# Altium schematic sheet DCDC-SPX3829m5.SchDoc
size Letter; SheetNumber: 4; SheetTotal: 7
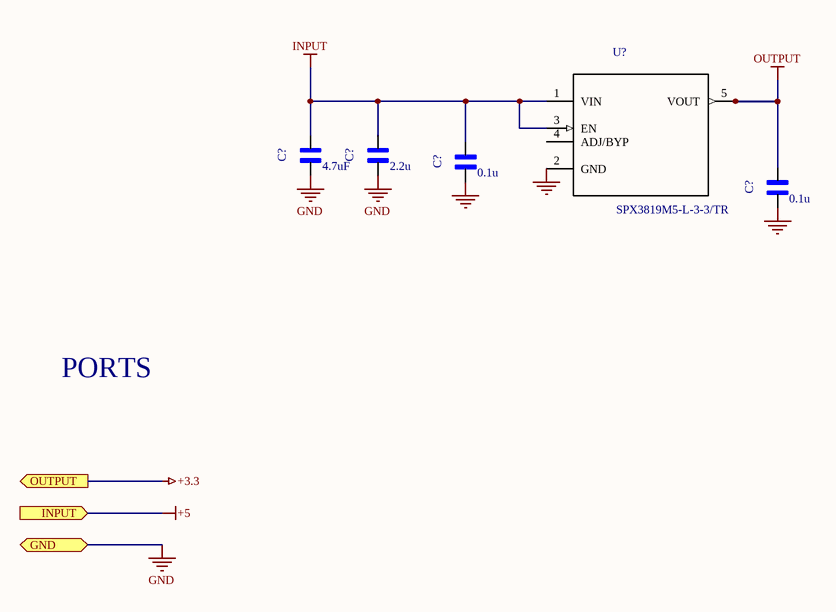
[diagram p0: DCDC-SPX3829m5.SchDoc]

## Parts
(Parts that share a designator on the sheet are numbered #1, #2 ... from top to bottom, then left to right.)
C?#1  value 4.7uF  [*CAP3216X125N]  (hidden comment: GRM31CR71H225KA88L)
C?#2  value 2.2u  [*CAP3216X125N]  (hidden comment: GRM31CR71H225KA88L)
C?#3  value 0.1u  [*CAPC1608X90]  (hidden comment: GX035C104MAT2-500)
C?#4  value 0.1u  [*CAPC1608X90]  (hidden comment: GX035C104MAT2-500)
U?  SPX3819M5-L-3-3/TR  [*SOT95P280X145-5N]

## Ports
GND (bidir), INPUT (in), OUTPUT (out)

## Nets
+3.3: port OUTPUT
+5: port INPUT
GND: C?#1.2 C?#2.2 C?#3.2 C?#4.2 U?.2(GND) ; port GND
INPUT: C?#1.1 C?#2.1 C?#3.1 U?.1(VIN) U?.3(EN)
OUTPUT: C?#4.1 U?.5(VOUT)

Not connected (* = marked no-connect by the designer): U? 4(ADJ/BYP)

## Notes on the sheet
- PORTS

## Library data of the parts
C?#1 C?#2 = GRM31CR71H225KA88L: 1206 2.2 uF 50 V В±10% Tolerance X7R SMT Multilayer Ceramic Capacitor; MF: Murata Electronics; Type: SMD; Package: 1206 Murata; SnapEDA_Link: https://www.snapeda.com/parts/GRM31CR71H225KA88L/Murata%20Electronics%20North%20America/view-part/?ref=snap; MP: GRM31CR71H225KA88L
C?#3 C?#4 = GX035C104MAT2-500: Cap Thin Film 0.1uf 50v 0603; MF: AVX; Pacage Metric: 1608; Type: SMD; Package: 0603 AVX; MP: GX035C104MAT2-500; SnapEDA_Link: https://www.snapeda.com/parts/GX035C104MAT2-500/AVX/view-part/?ref=snap
U? = SPX3819M5-L: Low Dropout Voltage Regulator, Adjustable 0.5A, В±1%, 2.5 to 16 Vin, 5-Pin SOT-23; MF: MaxLinear, Inc.; Value: 3V3; MP: SPX3819M5-L-3-3/TR; Package: SOT-23-5 Exar; SnapEDA_Link: https://www.snapeda.com/parts/SPX3819M5-L/MaxLinear%2C%20Inc./view-part/?ref=snap; Type: SMD; ChipDip_Link: https://www.chipdip.ru/product1/8003455237; HelpURL: http://www.farnell.com/datasheets/2614478.pdf